# EAGLE design MS5803-2BA (EAGLE 9.2.2)
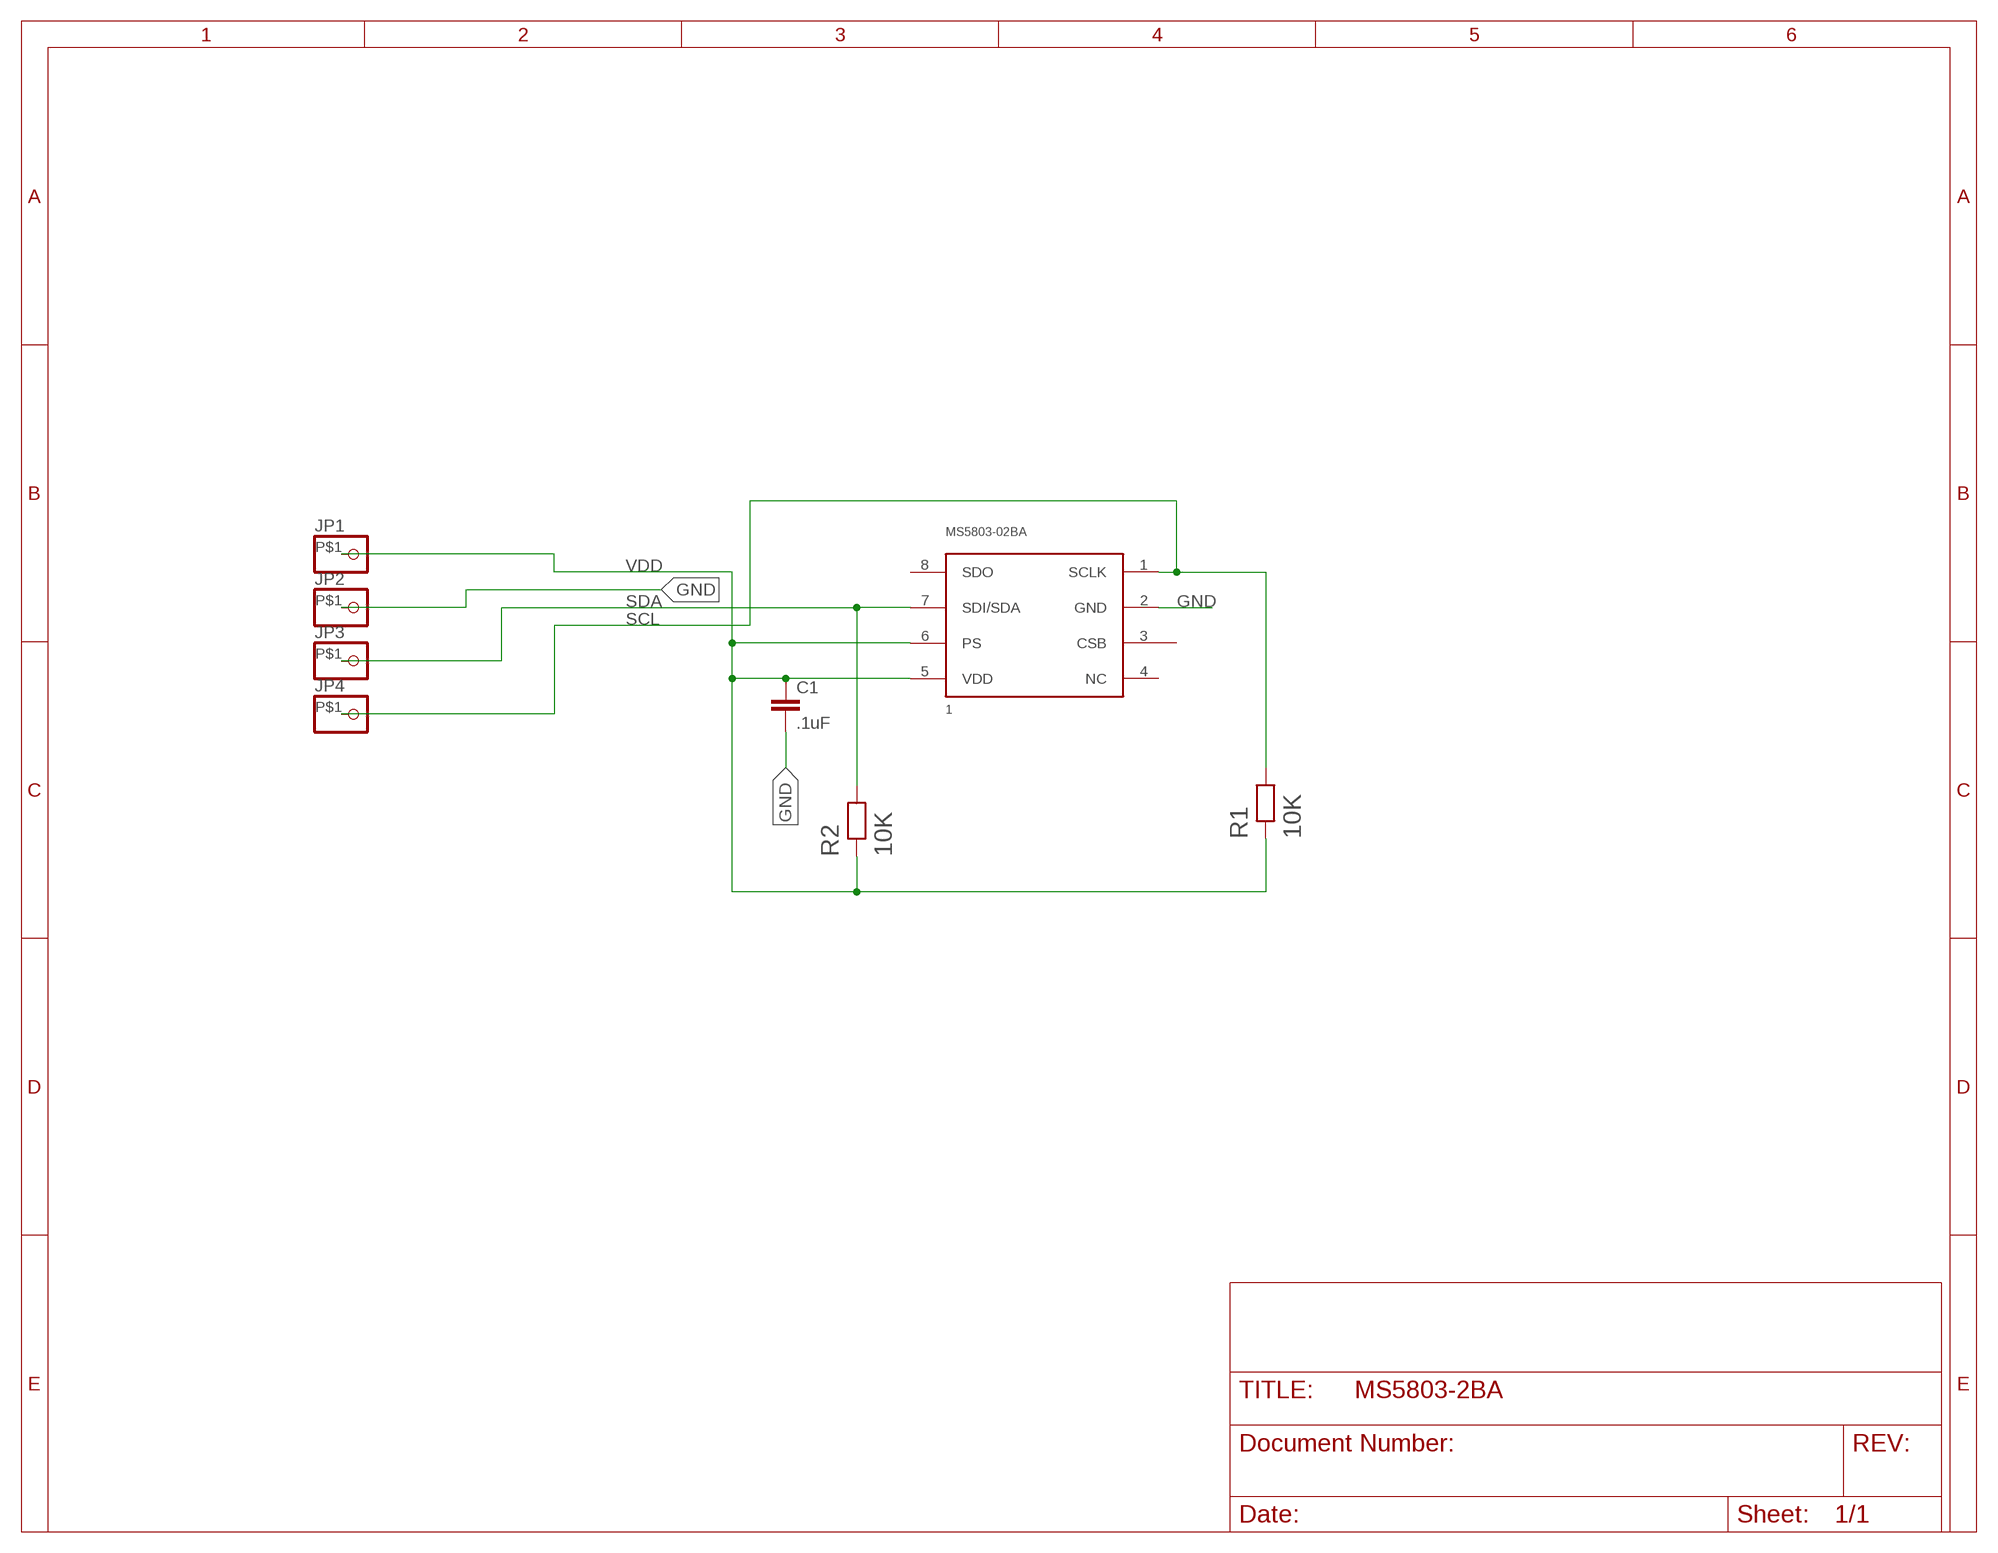
[diagram p0: schematic, sheet 1]

## Parts
C1  .1uF  C-EUC0805  [C0805]
JP1  PINHD-1X11X01SM  [1X01SM]
JP2  PINHD-1X11X01SM  [1X01SM]
JP3  PINHD-1X11X01SM  [1X01SM]
JP4  PINHD-1X11X01SM  [1X01SM]
MS5803-02BA  1  MS5803-02BASMD  [MS5803-02BA]
R1  10K  10KOHM_2012(0805)_SMDSMD  [2012(0805)RESISTOR]
R2  10K  10KOHM_2012(0805)_SMDSMD  [2012(0805)RESISTOR]

## Nets
GND: C1.2 JP2.P$1 MS5803-02BA.2(GND)
SCL: JP4.P$1 MS5803-02BA.1(SCLK) R1.2
SDA: JP3.P$1 MS5803-02BA.7(SDI/SDA) R2.2
VDD: C1.1 JP1.P$1 MS5803-02BA.5(VDD) MS5803-02BA.6(PS) R1.1 R2.1
Unconnected: MS5803-02BA.3(CSB) MS5803-02BA.4(NC) MS5803-02BA.8(SDO)

## Library data of the parts
C1 = rcl:C-EU: CAPACITOR, European symbol; SPICEPREFIX: C
JP1-JP4 = pinhead:PINHD-1X1: PIN HEADER
MS5803-02BA = OPEnS_Lab_parts:MS5803-02BA: MS5803-02BA Miniature Altimeter Module Specifications High resolution module, 20cm Fast conversion down to 1ms Low power, 1uA (standby < 0.15 uA ) Integrated digital pressure sensor ( 24 bit ΔΣ ADC) Supply voltage 1.8 to 3.6 V Operating range: 300 to 110mbar, -40 to +85°C Extended Pressure Range: 10 to 2000mbar I2C and SPI interface (Mode 0, 3) No external components (Internal Oscillator) Excellent long term stability Hermetically sealable for outdoor devices The MS5803-02BA is a new generation of high resolution altimeter sensors from TE Connectivity with SPI and I2C bus interface. It is optimized for altimeters and variometers with an altitude resolution of 20 cm. The sensor module includes a high linearity pressure sensor and an ultra-low power 24 bit ΔΣ ADC with internal factory calibrated coefficients. It provides a precise digital 24 Bit pressure and temperature value and different operation modes that allow the user to optimize for conversion speed and current consumption. A high resolution temperature output allows the implementation of an altimeter/thermometer function without any additional sensor. The MS5803-02BA can be interfaced to virtually any microcontroller. The communication protocol is simple, without the need of programming internal registers in the device. The gel protection and antimagnetic stainless steel cap allows the use in 100m water resistant altimeter/compass watches. This new sensor module generation is based on leading MEMS technology and latest benefits from TE proven experience and know-how in high volume manufacturing of altimeter modules, which have been widely used for over a decade. The sensing principle employed leads to very low hysteresis and high stability of both pressure and temperature signal.
R1 R2 = OPEnS_Lab_parts:10KOHM_2012(0805)_SMD

## Board
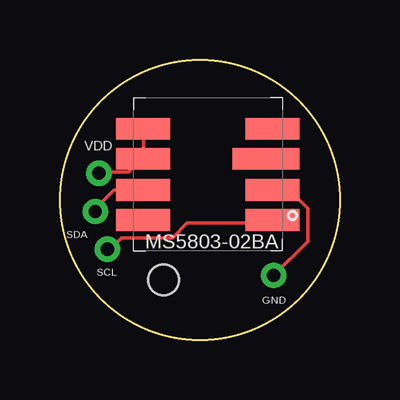
[diagram p1: board, top side]
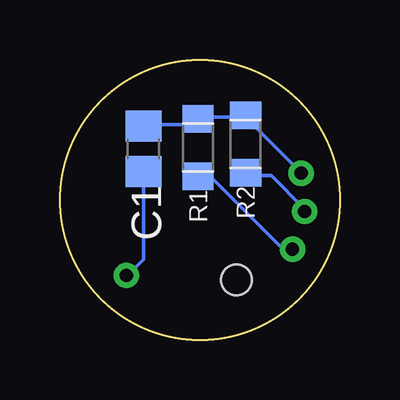
[diagram p2: board, bottom side, seen from below]

Size 11.68 x 11.68 mm. Coordinates in mm from the lower left corner, seen from the top.
Outline: circle at 5.84,5.84 radius 5.84
Copper layers (1*16): Top 0.035mm / dielectric 1.5mm / Bottom 0.035mm
Design rules "default": minimum track width 6mil, minimum drill 0.35mm, track to track 6mil, track to pad 6mil, pad to pad 6mil, via to via 6mil, smd to smd 6mil, copper to edge 40mil, drill to drill 6mil, minimum pad ring 10mil, minimum via ring 8mil, stop-mask expansion 4mil, vias tented up to drill 0mil, thermal gap 10mil
Holes 1.27 mm at 4.32,2.51

### Footprints (pad centres in the part's own frame; a part is rotated, then mirrored left to right if it is on the bottom)
C0805 = smd 1.3 x 1.5: 1 -0.95,0; 2 0.95,0
1X01SM = drill 0.55: P$1 0,0
MS5803-02BA = smd 2.25 x 0.9: 1 2.7,-1.9; 2 2.7,-0.65; 4 2.7,1.9; 5 -2.7,1.9; 6 -2.7,0.65; 7 -2.7,-0.65; 8 -2.7,-1.9 | smd 2.8 x 0.9: 3 2.42,0.65
2012(0805)RESISTOR = smd 1.15 x 1.3: 1 -1.2,0; 2 1.2,0

### Placement (x,y rotation side)
C1  8.2,7.98 270 bottom
JP1  1.63,6.96 0 top
JP2  8.92,2.69 0 top
JP3  1.47,5.36 0 top
JP4  1.98,3.78 0 top
MS5803-02BA  6.17,6.91 0 top
R1  5.92,8.03 270 bottom
R2  3.94,8.18 270 bottom

### Tracks (layer width: path | path; a pad name or v marks a point on that pad's centre or on a via)
GND
  Top 0.152: 9.27,5.94 8.97,5.94 MS5803-02BA.2 9.27,5.94 | 9.27,5.94 9.88,5.94 10.34,5.49 10.34,4.12 JP2.P$1
  Bottom 0.152: C1.2 8.2,3.35 8.81,2.74 JP2.P$1
SCL
  Top 0.152: 8.92,5.03 MS5803-02BA.1 8.81,4.88 5.31,4.88 4.7,4.27 2.57,4.27 2.11,3.81 JP4.P$1
  Bottom 0.152: 5.92,6.76 R1.2 5.92,6.71 5.31,6.71 2.41,3.81 2.11,3.81 JP4.P$1
SDA
  Top 0.152: MS5803-02BA.7 3.33,6.25 2.26,6.25 1.5,5.49 JP3.P$1
  Bottom 0.152: 3.89,7.06 R2.2 3.94,6.86 2.87,6.86 1.5,5.49 JP3.P$1
VDD
  Top 0.152: JP1.P$1 1.65,7.01 2.87,7.01 3.33,7.47 MS5803-02BA.6 3.48,7.62 3.48,8.69 MS5803-02BA.5
  Bottom 0.152: 3.94,9.3 5.92,9.3 R1.1 5.92,9.14 6.07,8.99 8.2,8.99 C1.1 | 3.94,9.3 1.65,7.01 JP1.P$1 | 3.94,9.3 R2.1

### Text on the board
tNames: VDD | SDA | SCL | GND